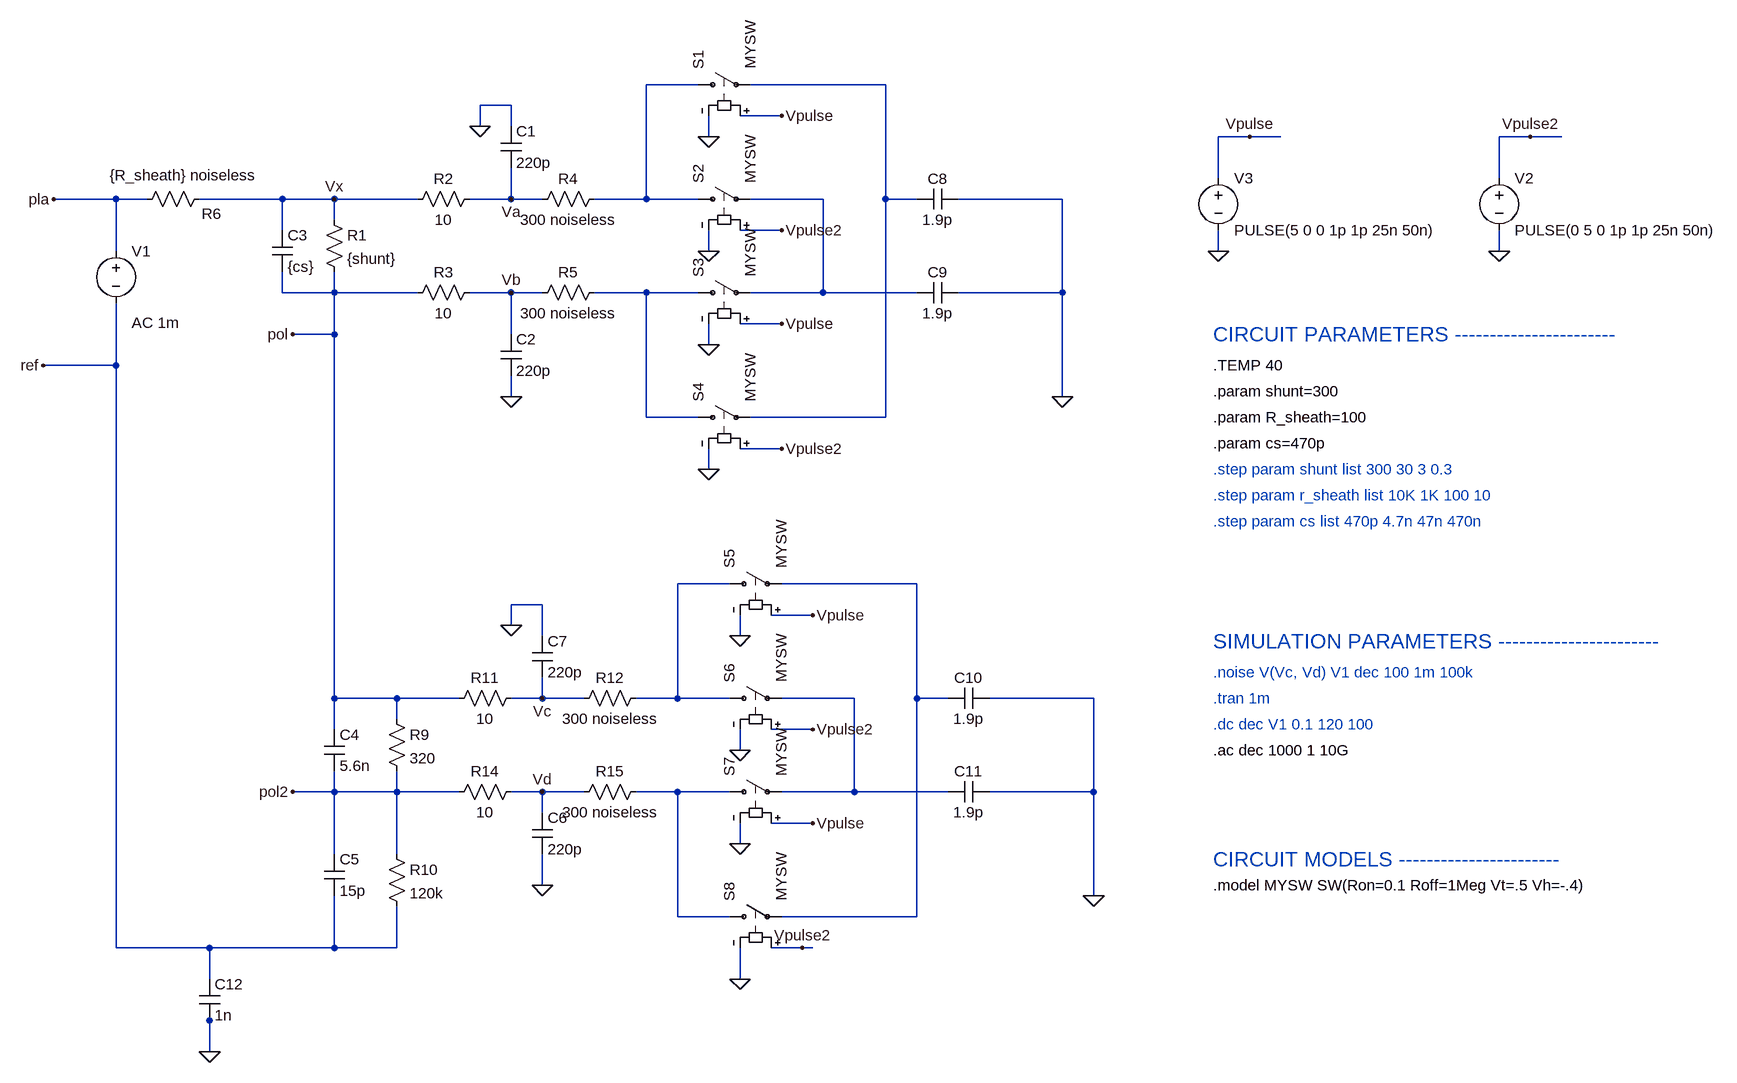
[diagram p0: schematic 1-floating_voltage.asc]
1-floating_voltage.asc, the LTspice schematic file:
Version 4.1
SHEET 1 2372 2936
WIRE 640 -112 560 -112
WIRE 928 -112 720 -112
WIRE 352 -80 304 -80
WIRE 768 -64 704 -64
WIRE 304 -48 304 -80
WIRE 352 -48 352 -80
WIRE 656 -32 656 -64
WIRE 1488 -32 1440 -32
WIRE 1536 -32 1488 -32
WIRE 1920 -32 1872 -32
WIRE 1968 -32 1920 -32
WIRE 1440 32 1440 -32
WIRE 1872 32 1872 -32
WIRE -256 64 -352 64
WIRE -208 64 -256 64
WIRE 0 64 -128 64
WIRE 80 64 0 64
WIRE 208 64 80 64
WIRE 352 64 352 16
WIRE 352 64 288 64
WIRE 400 64 352 64
WIRE 560 64 560 -112
WIRE 560 64 480 64
WIRE 640 64 560 64
WIRE 832 64 720 64
WIRE 928 64 928 -112
WIRE 976 64 928 64
WIRE 1200 64 1040 64
WIRE 80 96 80 64
WIRE 0 112 0 64
WIRE 768 112 704 112
WIRE -256 144 -256 64
WIRE 656 144 656 112
WIRE 1440 144 1440 112
WIRE 1872 144 1872 112
WIRE 0 208 0 176
WIRE 80 208 80 176
WIRE 80 208 0 208
WIRE 208 208 80 208
WIRE 352 208 288 208
WIRE 400 208 352 208
WIRE 560 208 480 208
WIRE 640 208 560 208
WIRE 832 208 832 64
WIRE 832 208 720 208
WIRE 976 208 832 208
WIRE 1200 208 1200 64
WIRE 1200 208 1040 208
WIRE 768 256 704 256
WIRE 80 272 80 208
WIRE 80 272 16 272
WIRE 352 272 352 208
WIRE 656 288 656 256
WIRE -256 320 -256 224
WIRE -256 320 -368 320
WIRE 352 368 352 336
WIRE 1200 368 1200 208
WIRE 560 400 560 208
WIRE 640 400 560 400
WIRE 928 400 928 64
WIRE 928 400 720 400
WIRE 768 448 704 448
WIRE 656 480 656 448
WIRE 688 656 608 656
WIRE 976 656 768 656
WIRE 400 688 352 688
WIRE 816 704 752 704
WIRE 352 720 352 688
WIRE 400 736 400 688
WIRE 704 736 704 704
WIRE 80 832 80 272
WIRE 176 832 80 832
WIRE 272 832 176 832
WIRE 400 832 400 800
WIRE 400 832 352 832
WIRE 464 832 400 832
WIRE 608 832 608 656
WIRE 608 832 544 832
WIRE 688 832 608 832
WIRE 880 832 768 832
WIRE 976 832 976 656
WIRE 1024 832 976 832
WIRE 1248 832 1088 832
WIRE 176 864 176 832
WIRE 80 880 80 832
WIRE 816 880 752 880
WIRE 704 912 704 880
WIRE 80 976 80 944
WIRE 80 976 16 976
WIRE 176 976 176 944
WIRE 176 976 80 976
WIRE 272 976 176 976
WIRE 400 976 352 976
WIRE 464 976 400 976
WIRE 608 976 544 976
WIRE 688 976 608 976
WIRE 880 976 880 832
WIRE 880 976 768 976
WIRE 1024 976 880 976
WIRE 1248 976 1248 832
WIRE 1248 976 1088 976
WIRE 400 1008 400 976
WIRE 816 1024 752 1024
WIRE 704 1056 704 1024
WIRE 80 1072 80 976
WIRE 176 1072 176 976
WIRE 400 1120 400 1072
WIRE 1248 1136 1248 976
WIRE 608 1168 608 976
WIRE 688 1168 608 1168
WIRE 976 1168 976 832
WIRE 976 1168 768 1168
WIRE -256 1216 -256 320
WIRE -112 1216 -256 1216
WIRE 80 1216 80 1136
WIRE 80 1216 -112 1216
WIRE 176 1216 176 1152
WIRE 176 1216 80 1216
WIRE 800 1216 752 1216
WIRE 816 1216 800 1216
WIRE -112 1264 -112 1216
WIRE 704 1264 704 1216
WIRE -112 1328 -112 1312
WIRE -112 1376 -112 1328
FLAG 352 368 0
FLAG 304 -48 0
FLAG 352 64 Va
FLAG 352 208 Vb
FLAG 80 64 Vx
FLAG 16 272 pol
FLAG 352 720 0
FLAG 400 1120 0
FLAG 400 832 Vc
FLAG 400 976 Vd
FLAG 1200 368 0
FLAG 768 -64 Vpulse
FLAG 768 256 Vpulse
FLAG 656 -32 0
FLAG 656 288 0
FLAG 1248 1136 0
FLAG 816 704 Vpulse
FLAG 816 1024 Vpulse
FLAG 704 736 0
FLAG 704 1056 0
FLAG 704 912 0
FLAG 704 1264 0
FLAG 656 144 0
FLAG 656 480 0
FLAG 800 1216 Vpulse2
FLAG 816 880 Vpulse2
FLAG 768 112 Vpulse2
FLAG 768 448 Vpulse2
FLAG 1440 144 0
FLAG 1872 144 0
FLAG 1488 -32 Vpulse
FLAG 1920 -32 Vpulse2
FLAG -352 64 pla
FLAG -368 320 ref
FLAG -112 1376 0
FLAG 16 976 pol2
SYMBOL res 64 80 R0
SYMATTR InstName R1
SYMATTR Value {shunt}
SYMBOL res 304 48 R90
WINDOW 0 0 56 VBottom 2
WINDOW 3 32 56 VTop 2
SYMATTR InstName R2
SYMATTR Value 10
SYMBOL res 192 224 R270
WINDOW 0 32 56 VTop 2
WINDOW 3 0 56 VBottom 2
SYMATTR InstName R3
SYMATTR Value 10
SYMBOL res 384 80 R270
WINDOW 0 32 56 VTop 2
WINDOW 3 0 56 VBottom 2
SYMATTR InstName R4
SYMATTR Value 300 noiseless
SYMBOL res 384 224 R270
WINDOW 0 32 56 VTop 2
WINDOW 3 0 56 VBottom 2
SYMATTR InstName R5
SYMATTR Value 300 noiseless
SYMBOL cap 336 -48 R0
SYMATTR InstName C1
SYMATTR Value 220p
SYMBOL cap 336 272 R0
SYMATTR InstName C2
SYMATTR Value 220p
SYMBOL res 160 848 R0
SYMATTR InstName R9
SYMATTR Value 320
SYMBOL res 160 1056 R0
SYMATTR InstName R10
SYMATTR Value 120k
SYMBOL cap 64 880 R0
SYMATTR InstName C4
SYMATTR Value 5.6n
SYMBOL cap 64 1072 R0
SYMATTR InstName C5
SYMATTR Value 15p
SYMBOL res 368 816 R90
WINDOW 0 0 56 VBottom 2
WINDOW 3 32 56 VTop 2
SYMATTR InstName R11
SYMATTR Value 10
SYMBOL res 560 816 R90
WINDOW 0 0 56 VBottom 2
WINDOW 3 32 56 VTop 2
SYMATTR InstName R12
SYMATTR Value 300 noiseless
SYMBOL res 368 960 R90
WINDOW 0 0 56 VBottom 2
WINDOW 3 32 56 VTop 2
SYMATTR InstName R14
SYMATTR Value 10
SYMBOL res 560 960 R90
WINDOW 0 0 56 VBottom 2
WINDOW 3 32 56 VTop 2
SYMATTR InstName R15
SYMATTR Value 300 noiseless
SYMBOL cap 384 1008 R0
SYMATTR InstName C6
SYMATTR Value 220p
SYMBOL cap 384 736 R0
SYMATTR InstName C7
SYMATTR Value 220p
SYMBOL sw 624 -112 R270
SYMATTR InstName S1
SYMATTR Value MYSW
SYMBOL sw 624 64 R270
SYMATTR InstName S2
SYMATTR Value MYSW
SYMBOL sw 624 208 R270
SYMATTR InstName S3
SYMATTR Value MYSW
SYMBOL sw 624 400 R270
SYMATTR InstName S4
SYMATTR Value MYSW
SYMBOL voltage 1872 16 R0
WINDOW 123 0 0 Left 0
WINDOW 39 0 0 Left 0
SYMATTR InstName V2
SYMATTR Value PULSE(0 5 0 1p 1p 25n 50n)
SYMBOL cap 1040 48 R90
WINDOW 0 0 32 VBottom 2
WINDOW 3 32 32 VTop 2
SYMATTR InstName C8
SYMATTR Value 1.9p
SYMBOL cap 1040 192 R90
WINDOW 0 0 32 VBottom 2
WINDOW 3 32 32 VTop 2
SYMATTR InstName C9
SYMATTR Value 1.9p
SYMBOL sw 672 656 R270
SYMATTR InstName S5
SYMATTR Value MYSW
SYMBOL sw 672 832 R270
SYMATTR InstName S6
SYMATTR Value MYSW
SYMBOL sw 672 976 R270
SYMATTR InstName S7
SYMATTR Value MYSW
SYMBOL sw 672 1168 R270
SYMATTR InstName S8
SYMATTR Value MYSW
SYMBOL cap 1088 816 R90
WINDOW 0 0 32 VBottom 2
WINDOW 3 32 32 VTop 2
SYMATTR InstName C10
SYMATTR Value 1.9p
SYMBOL cap 1088 960 R90
WINDOW 0 0 32 VBottom 2
WINDOW 3 32 32 VTop 2
SYMATTR InstName C11
SYMATTR Value 1.9p
SYMBOL voltage 1440 16 R0
WINDOW 123 0 0 Left 0
WINDOW 39 0 0 Left 0
SYMATTR InstName V3
SYMATTR Value PULSE(5 0 0 1p 1p 25n 50n)
SYMBOL res -112 48 R90
WINDOW 0 54 -3 VBottom 2
WINDOW 3 -36 40 VTop 2
SYMATTR InstName R6
SYMATTR Value {R_sheath} noiseless
SYMBOL cap -16 112 R0
SYMATTR InstName C3
SYMATTR Value {cs}
SYMBOL cap -128 1264 R0
SYMATTR InstName C12
SYMATTR Value 1n
SYMBOL voltage -256 128 R0
WINDOW 123 24 126 Left 2
WINDOW 39 0 0 Left 0
SYMATTR Value2 AC 1m
SYMATTR InstName V1
SYMATTR Value ""
TEXT 1432 912 Left 2 !.ac dec 1000 1 10G
TEXT 1432 872 Left 2 ;.dc dec V1 0.1 120 100
TEXT 1432 1120 Left 2 !.model MYSW SW(Ron=0.1 Roff=1Meg Vt=.5 Vh=-.4)
TEXT 1432 832 Left 2 ;.tran 1m
TEXT 1432 480 Left 2 ;.step param shunt list 300 30 3 0.3
TEXT 1432 560 Left 2 ;.step param cs list 470p 4.7n 47n 470n
TEXT 1432 520 Left 2 ;.step param r_sheath list 10K 1K 100 10
TEXT 1432 400 Left 2 !.param R_sheath=100
TEXT 1432 440 Left 2 !.param cs=470p
TEXT 1432 792 Left 2 ;.noise V(Vc, Vd) V1 dec 100 1m 100k
TEXT 1432 360 Left 2 !.param shunt=300
TEXT 1432 320 Left 2 !.TEMP 40
TEXT 1432 272 Left 3 ;CIRCUIT PARAMETERS -----------------------
TEXT 1432 744 Left 3 ;SIMULATION PARAMETERS -----------------------
TEXT 1432 1080 Left 3 ;CIRCUIT MODELS -----------------------

The netlist it stands for:
* 1-floating_voltage.asc
R1 Vx pol {shunt}
R2 Va Vx 10
R3 pol Vb 10
R4 Va N001 300 noiseless
R5 Vb N004 300 noiseless
C1 0 Va 220p
C2 Vb 0 220p
R9 pol pol2 320
R10 pol2 ref 120k
C4 pol pol2 5.6n
C5 pol2 ref 15p
R11 Vc pol 10
R12 N005 Vc 300 noiseless
R14 Vd pol2 10
R15 N008 Vd 300 noiseless
C6 Vd 0 220p
C7 0 Vc 220p
S1 N001 N002 Vpulse 0 MYSW
S2 N001 N003 Vpulse2 0 MYSW
S3 N004 N003 Vpulse 0 MYSW
S4 N004 N002 Vpulse2 0 MYSW
V2 Vpulse2 0 PULSE(0 5 0 1p 1p 25n 50n)
C8 0 N002 1.9p
C9 0 N003 1.9p
S5 N005 N006 Vpulse 0 MYSW
S6 N005 N007 Vpulse2 0 MYSW
S7 N008 N007 Vpulse 0 MYSW
S8 N008 N006 Vpulse2 0 MYSW
C10 0 N006 1.9p
C11 0 N007 1.9p
V3 Vpulse 0 PULSE(5 0 0 1p 1p 25n 50n)
R6 Vx pla {R_sheath} noiseless
C3 Vx pol {cs}
C12 ref 0 1n
V1 pla ref AC 1m
.ac dec 1000 1 10G
* .dc dec V1 0.1 120 100
.model MYSW SW(Ron=0.1 Roff=1Meg Vt=.5 Vh=-.4)
* .tran 1m
* .step param shunt list 300 30 3 0.3
* .step param cs list 470p 4.7n 47n 470n
* .step param r_sheath list 10K 1K 100 10
.param R_sheath=100
.param cs=470p
* .noise V(Vc, Vd) V1 dec 100 1m 100k
.param shunt=300
.TEMP 40
* CIRCUIT PARAMETERS -----------------------
* SIMULATION PARAMETERS -----------------------
* CIRCUIT MODELS -----------------------
.backanno
.end